# EAGLE design komahub-v1.2 (EAGLE 9.1.0)
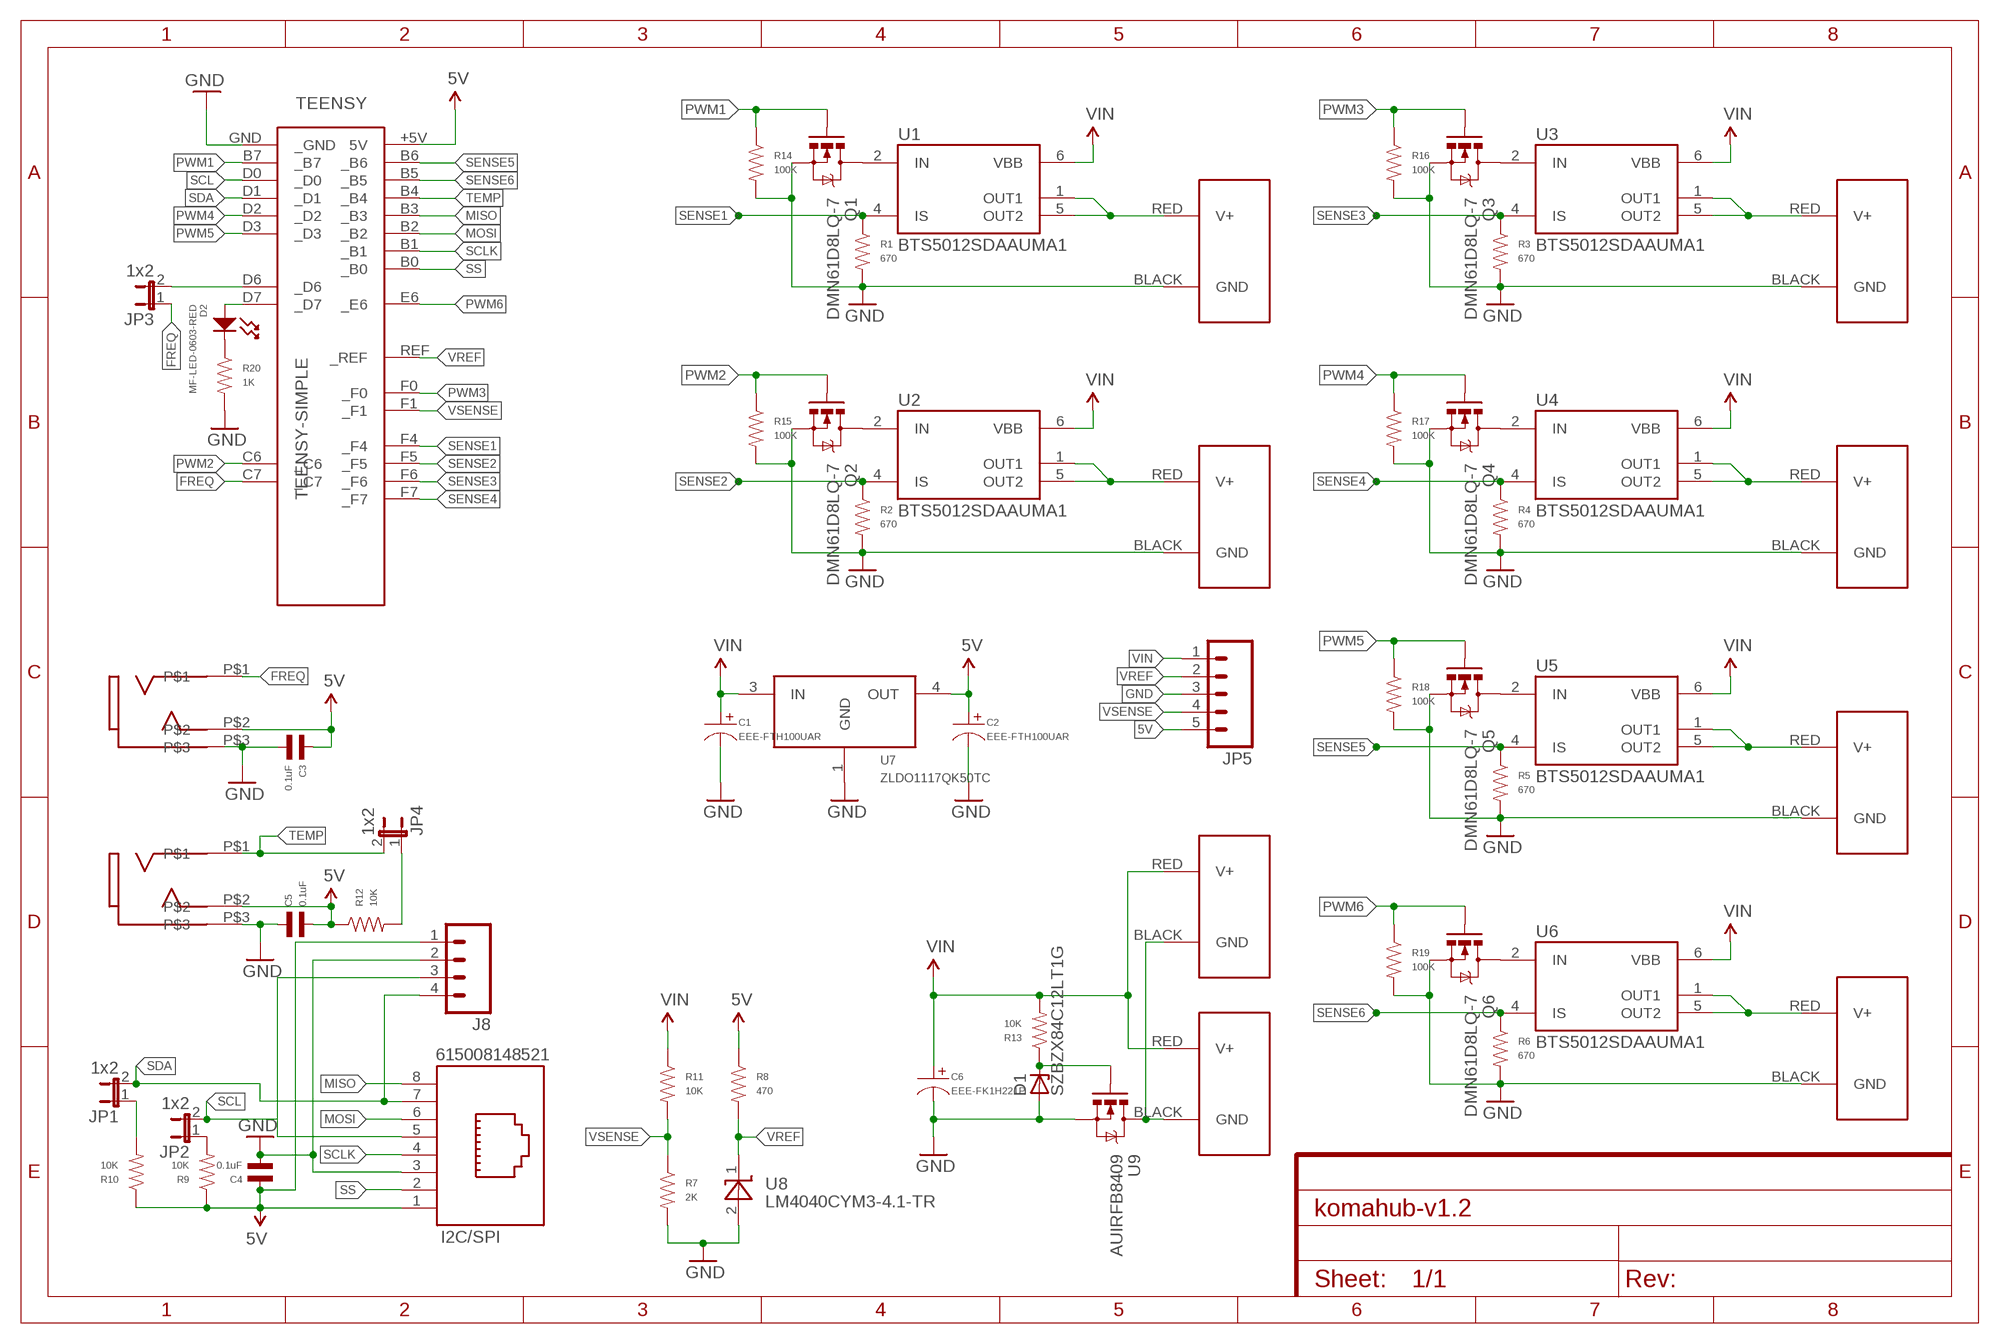
[diagram p0: schematic, sheet 1]
FRAME1 (FRAME-A4L): CNAME: KomaHub; CREVISION: 1.2; DESIGNER: Jari Saukkonen

## Parts
C1  EEE-FTH100UAR  CAPACITOR_P_4MM  [CP4MM]
C2  EEE-FTH100UAR  CAPACITOR_P_4MM  [CP4MM]
C3  0.1uF  CAPACITOR_NP_0603  [C0603]
C4  0.1uF  CAPACITOR_NP_0603  [C0603]
C5  0.1uF  CAPACITOR_NP_0603  [C0603]
C6  EEE-FK1H221P  CAPACITOR_P_10MM  [CP10MM]
D1  SZBZX84C12LT1G  ZENER-DIODESOT23  [SOT23]
D2  MF-LED-0603-RED  LED_SINGLE-0603-RED  [LED0603]
FREQ  35RASMT2BHNTRX  [35RASMT2BHNTRX]
I2C/SPI  615008148521  [615008148521]
J1  POWERPOLE_POWER25A_HORIZONTAL_G11  [POWERPOLE_PAIR_25A_HORIZ_G11]
J2  POWERPOLE_POWER25A_HORIZONTAL_G11  [POWERPOLE_PAIR_25A_HORIZ_G11]
J3  POWERPOLE_POWER25A_HORIZONTAL_G12  [POWERPOLE_PAIR_25A_HORIZ_G12]
J4  POWERPOLE_POWER25A_HORIZONTAL_G12  [POWERPOLE_PAIR_25A_HORIZ_G12]
J5  POWERPOLE_POWER25A_HORIZONTAL_G12  [POWERPOLE_PAIR_25A_HORIZ_G12]
J6  POWERPOLE_POWER25A_HORIZONTAL_G11  [POWERPOLE_PAIR_25A_HORIZ_G11]
J7  POWERPOLE_POWER25A_HORIZONTAL_G11  [POWERPOLE_PAIR_25A_HORIZ_G11]
J8  M04PTH  [1X04]
J9  POWERPOLE_POWER25A_HORIZONTAL_G12  [POWERPOLE_PAIR_25A_HORIZ_G12]
JP1  1x2  JUMPER-2PTH  [1X02]
JP2  1x2  JUMPER-2PTH  [1X02]
JP3  1x2  JUMPER-2PTH  [1X02]
JP4  1x2  JUMPER-2PTH  [1X02]
JP5  M05PTH  [1X05]
Q1  DMN61D8LQ-7  MOSFET-NCHANNELAO3404A  [SOT23-3]
Q2  DMN61D8LQ-7  MOSFET-NCHANNELAO3404A  [SOT23-3]
Q3  DMN61D8LQ-7  MOSFET-NCHANNELAO3404A  [SOT23-3]
Q4  DMN61D8LQ-7  MOSFET-NCHANNELAO3404A  [SOT23-3]
Q5  DMN61D8LQ-7  MOSFET-NCHANNELAO3404A  [SOT23-3]
Q6  DMN61D8LQ-7  MOSFET-NCHANNELAO3404A  [SOT23-3]
R1  670  RESISTOR_0603  [R0603]
R2  670  RESISTOR_0603  [R0603]
R3  670  RESISTOR_0603  [R0603]
R4  670  RESISTOR_0603  [R0603]
R5  670  RESISTOR_0603  [R0603]
R6  670  RESISTOR_0603  [R0603]
R7  2K  RESISTOR_0603  [R0603]
R8  470  RESISTOR_0603  [R0603]
R9  10K  RESISTOR_0603  [R0603]
R10  10K  RESISTOR_0603  [R0603]
R11  10K  RESISTOR_0603  [R0603]
R12  10K  RESISTOR_0603  [R0603]
R13  10K  RESISTOR_0603  [R0603]
R14  100K  RESISTOR_0603  [R0603]
R15  100K  RESISTOR_0603  [R0603]
R16  100K  RESISTOR_0603  [R0603]
R17  100K  RESISTOR_0603  [R0603]
R18  100K  RESISTOR_0603  [R0603]
R19  100K  RESISTOR_0603  [R0603]
R20  1K  RESISTOR_0603  [R0603]
TEENSY  TEENSY-SIMPLE  [TEENSY-SIMPLE]
TEMP  35RASMT2BHNTRX  [35RASMT2BHNTRX]
U1  BTS5012SDAAUMA1  BTS5016SDA  [TO114P998X235-5_6N]
U2  BTS5012SDAAUMA1  BTS5016SDA  [TO114P998X235-5_6N]
U3  BTS5012SDAAUMA1  BTS5016SDA  [TO114P998X235-5_6N]
U4  BTS5012SDAAUMA1  BTS5016SDA  [TO114P998X235-5_6N]
U5  BTS5012SDAAUMA1  BTS5016SDA  [TO114P998X235-5_6N]
U6  BTS5012SDAAUMA1  BTS5016SDA  [TO114P998X235-5_6N]
U7  ZLDO1117QK50TC  NCV1117  [DPAK]
U8  LM4040CYM3-4.1-TR  LM4040CYM3-2.5  [SOT-23]
U9  AUIRFB8409  [TO220AV]

## Nets
5V: C2.P$1 C3.P$1 C4.P$1 C5.P$2 FREQ.P$2 I2C/SPI.1 J8.1 JP5.5 R8.P$1 R9.P$1 R10.P$1 R12.P$1 TEENSY.+5V(5V) TEMP.P$2 U7.4(OUT)
FREQ: FREQ.P$1 JP3.1 TEENSY.C7(_C7)
GND: C1.P$2 C2.P$2 C3.P$2 C4.P$2 C5.P$1 C6.P$2 D1.1(A) FREQ.P$3 I2C/SPI.3 J1.BLACK(GND) J2.BLACK(GND) J3.BLACK(GND) J5.BLACK(GND) J7.BLACK(GND) J8.2 J9.BLACK(GND) JP5.3 Q1.2(S) Q2.2(S) Q3.2(S) Q4.2(S) Q5.2(S) Q6.2(S) R1.P$2 R2.P$2 R3.P$2 R4.P$2 R5.P$2 R6.P$2 R7.P$2 R14.P$2 R15.P$2 R16.P$2 R17.P$2 R18.P$2 R19.P$2 R20.P$2 TEENSY.GND(_GND) TEMP.P$3 U7.1(GND) U8.2(A) U9.3(S)
GNDIN: J4.BLACK(GND) J6.BLACK(GND) U9.2(D)
MISO: I2C/SPI.8 TEENSY.B3(_B3)
MOSI: I2C/SPI.6 TEENSY.B2(_B2)
N$1: JP3.2 TEENSY.D6(_D6)
N$2: JP2.1 R9.P$2
N$3: JP4.1 R12.P$2
N$4: JP1.1 R10.P$2
N$6: D1.3(C) R13.P$1 U9.1(G)
N$7: D2.CATHODE R20.P$1
N$8: D2.ANODE TEENSY.D7(_D7)
PWM1: Q1.1(G) R14.P$1 TEENSY.B7(_B7)
PWM2: Q2.1(G) R15.P$1 TEENSY.C6(_C6)
PWM3: Q3.1(G) R16.P$1 TEENSY.F0(_F0)
PWM4: Q4.1(G) R17.P$1 TEENSY.D2(_D2)
PWM5: Q5.1(G) R18.P$1 TEENSY.D3(_D3)
PWM6: Q6.1(G) R19.P$1 TEENSY.E6(_E6)
PWMT1: Q1.3(D) U1.2(IN)
PWMT2: Q2.3(D) U2.2(IN)
PWMT3: Q3.3(D) U3.2(IN)
PWMT4: Q4.3(D) U4.2(IN)
PWMT5: Q5.3(D) U5.2(IN)
PWMT6: Q6.3(D) U6.2(IN)
PWR1: J2.RED(V+) U1.1(OUT1) U1.5(OUT2)
PWR2: J3.RED(V+) U2.1(OUT1) U2.5(OUT2)
PWR3: J1.RED(V+) U3.1(OUT1) U3.5(OUT2)
PWR4: J5.RED(V+) U4.1(OUT1) U4.5(OUT2)
PWR5: J7.RED(V+) U5.1(OUT1) U5.5(OUT2)
PWR6: J9.RED(V+) U6.1(OUT1) U6.5(OUT2)
SCL: I2C/SPI.5 J8.3 JP2.2 TEENSY.D0(_D0)
SCLK: I2C/SPI.4 TEENSY.B1(_B1)
SDA: I2C/SPI.7 J8.4 JP1.2 TEENSY.D1(_D1)
SENSE1: R1.P$1 TEENSY.F4(_F4) U1.4(IS)
SENSE2: R2.P$1 TEENSY.F5(_F5) U2.4(IS)
SENSE3: R3.P$1 TEENSY.F6(_F6) U3.4(IS)
SENSE4: R4.P$1 TEENSY.F7(_F7) U4.4(IS)
SENSE5: R5.P$1 TEENSY.B6(_B6) U5.4(IS)
SENSE6: R6.P$1 TEENSY.B5(_B5) U6.4(IS)
SS: I2C/SPI.2 TEENSY.B0(_B0)
TEMP: JP4.2 TEENSY.B4(_B4) TEMP.P$1
VIN: C1.P$1 C6.P$1 J4.RED(V+) J6.RED(V+) JP5.1 R11.P$1 R13.P$2 U1.6(VBB) U2.6(VBB) U3.6(VBB) U4.6(VBB) U5.6(VBB) U6.6(VBB) U7.3(IN)
VREF: JP5.2 R8.P$2 TEENSY.REF(_REF) U8.1(C)
VSENSE: JP5.4 R7.P$1 R11.P$2 TEENSY.F1(_F1)

## Library data of the parts
C1 C2 = MF_Passives:CAPACITOR_P: Library: MF_Passives Description: Device for Polarized Capacitors. Manufacture part number (MPN), Voltage Rating, and Tolerance can be added via Attributes. Check https://factory.macrofab.com/parts for the house parts list.; MPN: MF-CAP-4MM-10uF; POPULATE: 1
C3-C5 = MF_Passives:CAPACITOR_NP: Library: MF_Passives Description: Device for Non-Polarized Capacitors. Manufacture part number (MPN) can be added via Attributes. Check https://factory.macrofab.com/parts for the house parts list.; POPULATE: 1
C6 = MF_Passives:CAPACITOR_P: Library: MF_Passives Description: Device for Polarized Capacitors. Manufacture part number (MPN), Voltage Rating, and Tolerance can be added via Attributes. Check https://factory.macrofab.com/parts for the house parts list.; MPN: EEE-FT1H221AP; POPULATE: 1
D1 = diode:ZENER-DIODE: Z-Diode
D2 = MF_LEDs:LED_SINGLE: Library: MF_LEDs Description: Device for Single LED Packages. Manufacture part number (MFG#) can be added via Attributes.; HOUSEPART: YES; MPN: MF-LED-0603-RED; POPULATE: 1; URL: https://factory.macrofab.com/part/MF-LED-0603-RED
FREQ TEMP = alvarop-lib:35RASMT2BHNTRX
I2C/SPI = EAGLE-INPUT_OUTPUT_CONNECTORS-rev17a:615008148521: WR-MJ_Modular Jacks_Plastic WR-MJ_Modular Jacks_Plastic_Horizontal_Tab UP <http://katalog.we-online.de/media/images/eican/Con_WR-MJ_Horizontal_Plastic%20_615008148521_pf2.jpg> Details see: http://katalog.we-online.de/en/em/MJ_HORIZONTAL_PLASTIC_8P8C_TAB_UP Created 2014-12-22, aslant tao 2014 (C) Würth Elektronik
J1-J7 J9 = powerpoles:POWERPOLE_POWER: Anderson Powerpole Power Connector using ameteur radio standard layout
J8 = SparkFun-Connectors:M04: Header 4 Standard 4-pin 0.1" header. Use with straight break away headers (SKU : PRT-00116), right angle break away headers (PRT-00553), swiss pins (PRT-00743), machine pins (PRT-00117), and female headers (PRT-00115). Molex polarized connector foot print use with SKU : PRT-08231 with associated crimp pins and housings. 1MM SMD Version SKU: PRT-10208; PROD_ID: CONN-09696
JP1-JP4 = SparkFun-Retired:JUMPER-2: Jumper Basic 0.1" spaced jumper. Use with breakaway headers.
JP5 = SparkFun-Connectors:M05: Header 5 Standard 5-pin 0.1" header. Use with straight break away headers (SKU : PRT-00116), right angle break away headers (PRT-00553), swiss pins (PRT-00743), machine pins (PRT-00117), and female headers (PRT-00115). Molex polarized connector foot print use with SKU : PRT-08230 with associated crimp pins and housings.
Q1-Q6 = SparkFun-DiscreteSemi:MOSFET-NCHANNEL: Common NMOSFET Parts MFG P/N Store ID Prod ID FDD8780 TRANS-09984 SI7820DN TRANS-11055 FDS6630A IC-08089 2N7002PW TRANS-11151 FQP30N06L COM-10213 TRANS-10060 BSS123LT1G TRANS-08345 BSS138 TRANS-00830 BS170 2N7000; PROD_ID: TRAN-12988
R1-R6 = MF_Passives:RESISTOR: Library: MF_Passives Description: Device for Resistors. Manufacture part number (MPN), Voltage, Tolerance, and Wattage Rating can be added via Attributes. Check https://factory.macrofab.com/parts for the house parts list.; MPN: CR0603-FX-6800ELF; POPULATE: 1
R7 R14-R19 = MF_Passives:RESISTOR: Library: MF_Passives Description: Device for Resistors. Manufacture part number (MPN), Voltage, Tolerance, and Wattage Rating can be added via Attributes. Check https://factory.macrofab.com/parts for the house parts list.; MPN: MF-RES-0603-2K; POPULATE: 1
R8 = MF_Passives:RESISTOR: Library: MF_Passives Description: Device for Resistors. Manufacture part number (MPN), Voltage, Tolerance, and Wattage Rating can be added via Attributes. Check https://factory.macrofab.com/parts for the house parts list.; MPN: MF-RES-0603-470; POPULATE: 1
R9-R13 = MF_Passives:RESISTOR: Library: MF_Passives Description: Device for Resistors. Manufacture part number (MPN), Voltage, Tolerance, and Wattage Rating can be added via Attributes. Check https://factory.macrofab.com/parts for the house parts list.; MPN: MF-RES-0603-10K; POPULATE: 1
R20 = MF_Passives:RESISTOR: Library: MF_Passives Description: Device for Resistors. Manufacture part number (MPN), Voltage, Tolerance, and Wattage Rating can be added via Attributes. Check https://factory.macrofab.com/parts for the house parts list.; POPULATE: 1
TEENSY = teensy:TEENSY-SIMPLE: Teensy 2.0 Original Design by Clint Fisher Modified Design by Tamir Emran Licensed Under Creative Commons Attribution-ShareAlike 3.0 Unported (CC BY-SA 3.0)
U1-U6 = BTS5016SDA:BTS5016SDA: BTS5016SDA Smart High-Side Power Switch TO114P998X235-5_6N
U7 = on-semiconductor:NCV1117
U8 = GuShH:LM4040
U9 = components:AUIRFB8409; MPN: AUIRFB8409

## Board
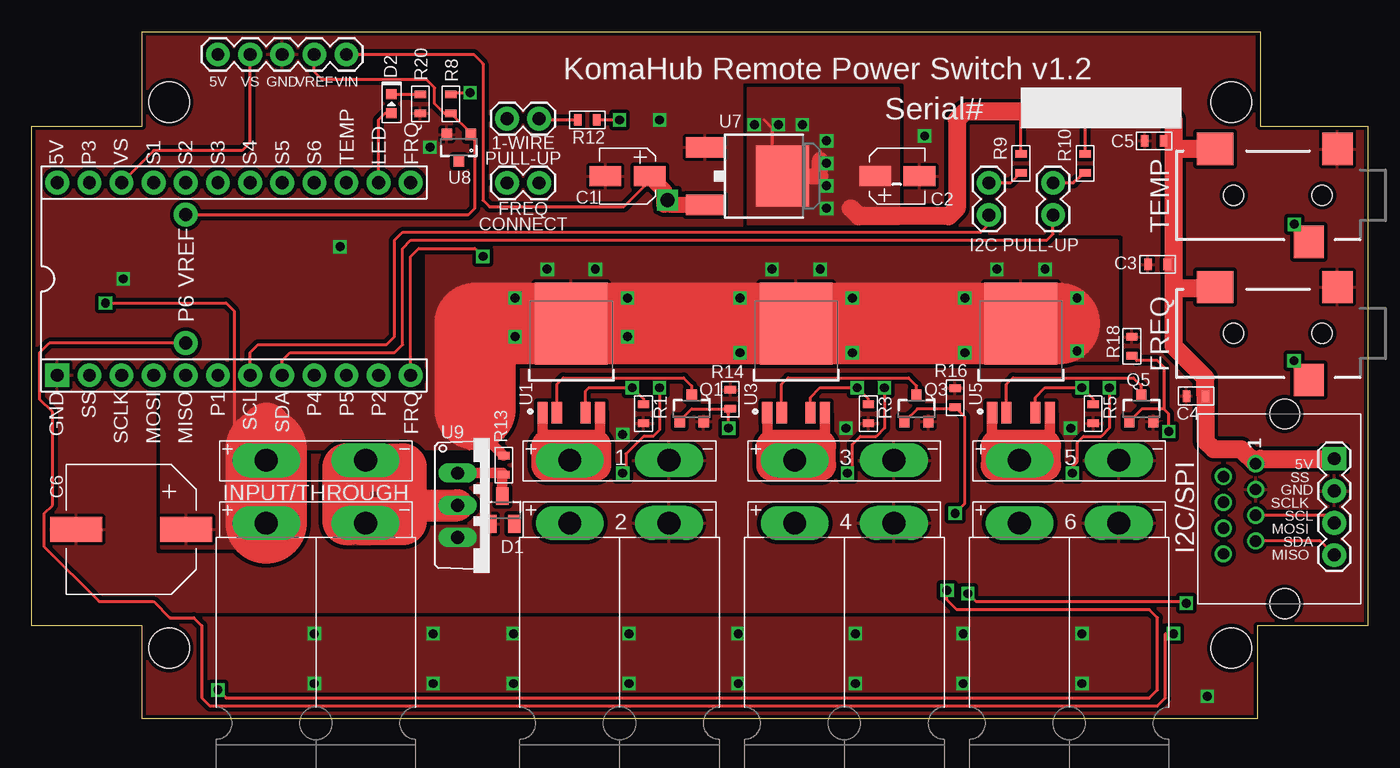
[diagram p1: board, top side]
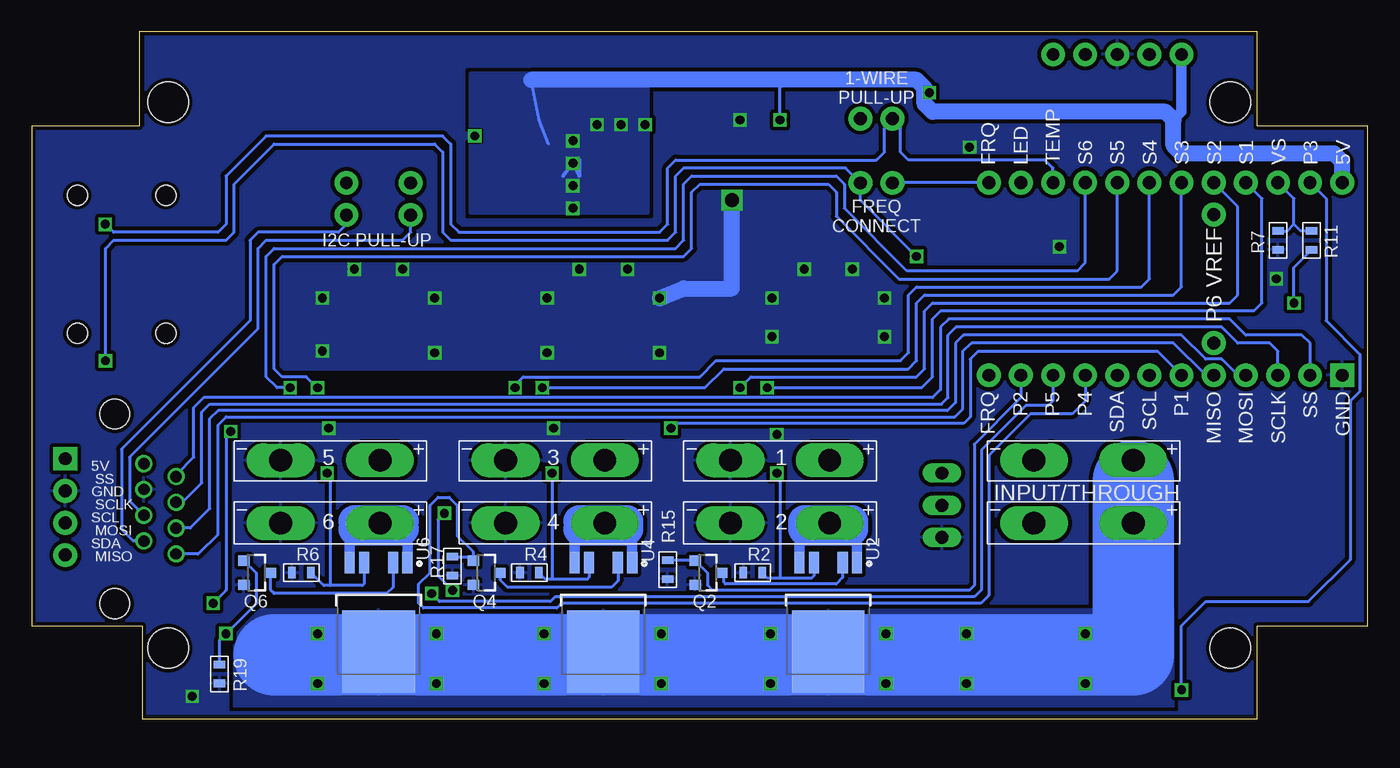
[diagram p2: board, bottom side, seen from below]

Size 105.66 x 54.36 mm. Coordinates in mm from the lower left corner, seen from the top.
Outline: 8.76,0 8.76,7.37 0,7.37 0,46.86 8.76,46.86 8.76,54.36 97.16,54.36 97.16,46.86 105.66,46.86 105.66,7.37 96.9,7.37 96.9,0 8.76,0
Copper layers (1*16): Top 0.035mm / dielectric 1.5mm / Bottom 0.035mm
Design rules "MF_Standard_2_Layer *": minimum track width 5mil, minimum drill 12mil, track to track 5mil, track to pad 5mil, pad to pad 5mil, via to via 5mil, smd to smd 0mil, copper to edge 10mil, drill to drill 10mil, minimum pad ring 6mil, minimum via ring 6mil, stop-mask expansion 2mil, vias tented up to drill 45mil, thermal gap 10mil
Holes 3.2 mm at 94.87,48.77 94.87,5.59 10.87,48.77 10.87,5.59

### Footprints (pad centres in the part's own frame; a part is rotated, then mirrored left to right if it is on the bottom)
CP4MM = smd 1.6 x 2.5: P$1 0,-1.75; P$2 0,1.75
C0603 = smd 0.6 x 0.9: P$1 -0.75,0; P$2 0.75,0
CP10MM = smd 2 x 4.1: P$1 0,-4.35; P$2 0,4.35
SOT23 = smd 1 x 1.4: 1 -0.95,-1.1; 2 0.95,-1.1; 3 0,1.1
LED0603 = smd 0.8 x 0.8: ANODE 0.75,0; CATHODE -0.75,0
35RASMT2BHNTRX = smd 2.4 x 2.55: P$1 -2.44,3.675; P$3 -4.7,-3.675 | smd 2.9 x 2.55: P$2 4.96,-3.675 | hole 1.6: -3.5,0; 3.5,0
615008148521 = drill 0.9: 1 3.57,2.3; 2 2.55,4.84; 3 1.53,2.3; 4 0.51,4.84; 5 -0.51,2.3; 6 -1.53,4.84; 7 -2.55,2.3; 8 -3.57,4.84 | hole 2.36: -7.5,0; 7.5,0
POWERPOLE_PAIR_25A_HORIZ_G11 = drill 1.8 long: BLACK -3.925,-6.096; RED 3.925,-6.096
POWERPOLE_PAIR_25A_HORIZ_G12 = drill 1.8 long: BLACK -3.925,-1.13; RED 3.925,-1.13
1X04 = drill 1.016 pad 1.88 square: 1 0,0 | drill 1.016 pad 1.88: 2 2.54,0; 3 5.08,0; 4 7.62,0
1X02 = drill 1.016 pad 1.88: 1 0,0; 2 2.54,0
1X05 = drill 1.016 pad 1.88: 1 0,0; 2 2.54,0; 3 5.08,0; 4 7.62,0; 5 10.16,0
SOT23-3 = smd 0.8 x 0.9: 1 -0.95,-1; 2 0.95,-1; 3 0,1.1
R0603 = smd 0.6 x 0.9: P$1 -0.75,0; P$2 0.75,0
TEENSY-SIMPLE = drill 1.016 pad 1.88: +5V -13.97,7.62; B0 -11.43,-7.62; B1 -8.89,-7.62; B2 -6.35,-7.62; B3 -3.81,-7.62; B4 8.89,7.62; B5 6.35,7.62; B6 3.81,7.62; B7 -1.27,-7.62; C6 11.43,-7.62; C7 13.97,-7.62; D0 1.27,-7.62; D1 3.81,-7.62; D2 6.35,-7.62; D3 8.89,-7.62; D6 13.97,7.62; D7 11.43,7.62; E6 -3.81,-5.08; F0 -11.43,7.62; F1 -8.89,7.62; F4 -6.35,7.62; F5 -3.81,7.62; F6 -1.27,7.62; F7 1.27,7.62; REF -3.81,5.08 | drill 1.016 pad 1.88 square: GND -13.97,-7.62
TO114P998X235-5_6N = smd 1.7 x 0.8: 1 -4.75,2.28; 2 -4.75,1.14; 4 -4.75,-1.14; 5 -4.75,-2.28 | smd 6.5 x 5.75: 6 2.3,0
DPAK = smd 1.6 x 3: 1 -2.28,-2.77; 3 2.28,-2.77 | smd 4.826 x 4.191: 4 0,3.366
SOT-23 = smd 0.8 x 0.9: 1 -0.95,-1; 2 0.95,-1; 3 0,1.1
TO220AV = drill 1.016 long: 1 -2.54,-2.54; 2 0,-2.54; 3 2.54,-2.54

### Placement (x,y rotation side)
C1  47.12,42.93 90 top
C2  68.45,42.93 270 top
C3  89.03,35.94 180 top
C4  92.08,25.53 180 top
C5  88.77,45.72 0 top
C6  7.87,14.99 90 top
D1  37.21,16.51 0 top
D2  28.45,48.64 270 top
FREQ  98.55,30.48 180 top
I2C/SPI  99.09,16.61 90 top
J1  64.26,14.35 180 top
J2  46.48,14.35 180 top
J3  46.48,14.35 180 top
J4  22.48,14.35 180 top
J5  64.26,14.35 180 top
J6  22.48,14.35 180 top
J7  82.04,14.35 180 top
J8  103,20.57 270 top
J9  82.04,14.35 180 top
JP1  80.77,42.39 270 top
JP2  75.69,42.39 270 top
JP3  40.13,42.39 180 top
JP4  40.13,47.47 180 top
JP5  24.89,52.55 180 top
Q1  52.2,24.51 0 top
Q2  52.2,11.56 270 bottom
Q3  69.98,24.51 0 top
Q4  69.72,11.56 270 bottom
Q5  87.76,24.51 0 top
Q6  87.88,11.56 270 bottom
R1  48.39,24.13 270 top
R2  48.64,11.56 180 bottom
R3  66.17,24.13 270 top
R4  66.29,11.56 180 bottom
R5  83.95,24.13 270 top
R6  84.33,11.56 180 bottom
R7  7.11,37.85 270 bottom
R8  33.15,48.64 270 top
R9  78.23,43.94 270 top
R10  83.31,43.94 270 top
R11  4.45,37.85 90 bottom
R12  43.94,47.37 180 top
R13  37.34,20.07 90 top
R14  55.24,25.27 90 top
R15  55.37,11.81 270 bottom
R16  73.03,25.4 90 top
R17  72.39,12.07 270 bottom
R18  87,29.46 90 top
R19  90.8,3.56 270 bottom
R20  30.73,48.64 270 top
TEENSY  16,34.8 0 top
TEMP  98.55,41.4 180 top
U1  42.67,28.96 90 top
U2  42.67,7.62 270 bottom
U3  60.45,28.96 90 top
U4  60.45,7.62 270 bottom
U5  78.23,28.96 90 top
U6  78.23,7.62 270 bottom
U7  56.01,42.93 270 top
U8  33.78,45.21 180 top
U9  36.22,16.89 270 top

### Tracks (layer width: path | path; a pad name or v marks a point on that pad's centre or on a via)
5V  (via drill 0.7)
  Top 0.254: 78.98,47.87 79.12,48.01 79.26,47.87 | FREQ.P$2 93.21,34.02 | 80,47.87 80.14,48.01 80.28,47.87 | R9.P$1 78.23,48.01 | R10.P$1 83.31,47.5 82.68,48.01 | 57.91,47.37 58.55,46.74 58.55,43.75 | R8.P$1 33.29,49.53 v34.67,49.53 | C5.P$2 90.41,44.31 90.3,44.2 | C3.P$1 89.78,34.56 90.3,34.04 | R12.P$1 v46.48,47.37
  Top 0.305: 62.36,44.83 62.36,44.2
  Top 0.406: 58.55,43.75 U7.4
  Top 1.27: U7.4 62.36,42.93 62.36,44.2
  Top 1.422: 64.77,40.39 65.41,39.75 72.52,39.75 73.15,40.39 73.15,47.37 73.79,48.01 78.23,48.01 79.12,48.01 80.14,48.01 82.68,48.01 89.66,48.01 90.3,47.37 90.3,44.58 | 90.3,44.58 90.3,44.2 90.3,34.04 90.3,32.77 | 90.3,32.77 90.3,29.48 92.83,26.95 C4.P$1 92.83,21.98 93.47,21.34 95.63,21.34 I2C/SPI.1 97.18,20.57 J8.1 103,20.7 | 93.21,34.02 90.28,34.02 90.3,32.77 | TEMP.P$2 90.8,45.08 90.3,44.58
  Bottom 0.254: 64.77,45.47 65.53,47.37 66.17,50.55 | v34.67,49.53 35.37,50.23 | v46.48,47.37 46.48,50.55
  Bottom 0.305: 63.63,42.93 v62.86,43.94 62.36,42.93 62.36,44.2
  Bottom 0.813: JP5.5 14.73,48.01 15.37,47.37
  Bottom 1.27: TEENSY.+5V 2.03,44.07 2.67,44.7 14.73,44.7 15.37,45.34 15.37,47.37 16,48.01 34.42,48.01 35.05,48.64 35.05,49.91 35.37,50.23 35.69,50.55 46.48,50.55 66.17,50.55
  other vias: 62.86,40.39 62.86,45.72 57.15,46.99 59.05,46.99 60.96,46.99 62.86,42.16
  pour Top (no thermals): 56.64,49.86 56.64,39.17 68.58,39.17 68.58,49.86
  pour Bottom (no thermals): 56.9,51.05 70.99,51.05 70.99,40.01 56.9,40.01
FREQ  (via drill 0.7)
  Top 0.254: TEENSY.C7 29.97,36.58 30.61,37.21 35.05,37.21 v35.69,36.58 | v99.82,28.32 100.98,27.05 FREQ.P$1
  Bottom 0.254: v99.82,28.32 99.82,37.21 99.19,37.85 90.3,37.85 89.66,38.48 89.66,42.29 86.49,45.47 73.79,45.47 73.15,44.83 73.15,38.48 72.52,37.85 55.37,37.85 54.74,38.48 54.74,42.93 54.1,43.56 41.3,43.56 JP3.1 40.13,41.02 v35.69,36.58
GND  (via drill 0.7)
  Top 0.254: U7.1 53.24,45.24 53.47,45.47
  other vias: 46.74,22.48 64.39,22.99 82.17,22.99 24.38,37.34 92.96,1.78 7.24,34.8 31.5,45.21 70.61,46.1 49.66,47.37
  pour Top (isolate 0.305, rank 2): 0.13,46.74 9.02,46.74 9.02,54.36 96.65,54.36 96.65,46.74 105.54,46.74 105.54,7.37 96.65,7.37 96.65,-0.25 9.02,-0.25 9.02,7.37 0.13,7.37
  pour Bottom (isolate 0.305, rank 2): 0.13,46.74 9.02,46.74 9.02,54.36 96.65,54.36 96.65,46.74 105.54,46.74 105.54,7.37 96.65,7.37 96.65,-0.25 9.02,-0.25 9.02,7.37 0.13,7.37
  pour Top (no thermals): 31.88,15.24 35.69,15.24 35.69,11.81 31.88,11.81
GNDIN
  Top 0.254: 26.16,15.62 26.16,19.05 J6.BLACK | J4.BLACK 31.1,15.48 30.61,16.89
  Top 2.54: 30.61,16.89 U9.2 | J4.BLACK 25.03,15.62
  Top 3.81: 25.03,15.62 24.89,15.62 24.89,19.89 29.34,19.89 29.34,15.62 26.16,15.62
  pour Top: 25.53,18.8 25.53,16.89 28.07,16.89 28.07,18.8
  pour Top: 26.8,13.72 24.89,13.72 24.89,15.62 26.8,15.62
MISO
  Bottom 0.254: TEENSY.B3 12.83,27.18 15.37,29.72 31.34,29.72 32.03,29.08 32.03,24.51 32.66,23.88 90.3,23.88 90.93,23.24 90.93,14.61 92.5,13.04 I2C/SPI.8
MOSI
  Bottom 0.254: TEENSY.B2 10.29,27.18 11.56,28.45 12.83,28.45 14.73,30.35 31.98,30.35 32.61,29.72 32.61,25.02 33.25,24.38 90.93,24.38 91.57,23.75 91.57,16.64 93.12,15.08 I2C/SPI.6
N$1
  Bottom 0.254: TEENSY.D6 37.57,42.42 JP3.2
N$2
  Top 0.254: JP2.1 77.43,42.39 R9.P$2
N$3
  Top 0.254: JP4.1 40.23,47.37 R12.P$2
N$4
  Top 0.254: 82.92,42.93 R10.P$2 82.39,42.39 JP1.1
N$6
  Top 0.813: U9.1 37.21,19.43 | 37.21,19.43 37.22,19.43 R13.P$1 | D1.3 37.21,19.43
N$7
  Top 0.254: D2.CATHODE R20.P$1
N$8
  Top 0.254: TEENSY.D7 27.43,47.37 27.95,47.89 D2.ANODE
PWM1  (via drill 0.7)
  Top 0.254: Q1.1 51.25,23.56 52.2,24.51 54.74,24.51 54.93,24.32 | v55.12,22.99 55.12,24.13 54.93,24.32 | R14.P$1 55.13,24.52 54.93,24.32
  Bottom 0.254: TEENSY.B7 16.64,29.08 30.81,29.08 31.45,28.45 31.45,23.88 31.95,23.37 54.74,23.37 v55.12,22.99
PWM2
  Bottom 0.254: TEENSY.C6 27.43,25.4 31.12,21.72 31.12,10.54 31.5,10.16 51.82,10.16 52.2,10.54 52.2,11.51 Q2.1 53.25,12.56 R15.P$1
PWM3  (via drill 0.7)
  Top 0.254: v73.03,16.26 73.79,17.02 73.79,23.88 73.15,24.51 73.03,24.51 | 73.03,24.51 70.03,24.51 Q3.1 | v14.73,2.29 15.37,1.65 88.39,1.65 89.03,2.29 89.03,8 88.39,8.64 73.15,8.64 72.39,9.4 v72.39,10.16 | R16.P$1 73.03,24.51
  Bottom 0.254: TEENSY.F0 3.3,41.15 3.3,31.5 0.64,28.83 0.64,25.91 1.4,25.15 1.4,12.57 4.7,9.27 12.83,9.27 14.73,7.37 v14.73,2.29 | v73.03,16.26 73.53,15.75 73.53,11.3 v72.39,10.16
PWM4
  Bottom 0.254: TEENSY.D2 22.35,25.15 23.37,24.13 26.67,24.13 29.97,20.83 29.97,9.78 30.61,9.14 63.75,9.14 64.14,8.76 74.68,8.76 75.06,9.14 75.06,10.67 74.17,11.56 74.17,16.89 73.53,17.53 72.64,17.53 72.01,16.89 72.01,14.48 70.72,13.19 Q4.1 71.03,12.82 R17.P$1
PWM5  (via drill 0.7)
  Top 0.254: v74.04,9.91 74.68,9.27 91.19,9.27 v91.31,9.14 | v89.92,22.73 89.92,24.13 89.53,24.51 | 89.53,24.51 87.81,24.51 Q5.1 | 89.53,24.51 89.53,27.81 89.03,28.32 87.39,28.32 R18.P$1
  Bottom 0.254: TEENSY.D3 24.89,25.15 25.27,24.77 27.05,24.77 30.56,21.26 30.56,10.21 31.12,9.65 64.26,9.65 64.64,9.27 73.41,9.27 v74.04,9.91 | v89.92,22.73 90.3,22.35 90.3,10.16 v91.31,9.14
PWM6  (via drill 0.7)
  Top 0.254: TEENSY.E6 1.4,29.72 0.64,28.96 0.64,25.27 1.65,24.26 1.65,16.89 1.02,16.26 1.02,13.59 5.33,9.27 9.65,9.27 10.92,8 12.83,8 13.46,7.37 13.46,1.65 14.1,1.02 89.03,1.02 89.66,1.65 89.66,6.73 v90.3,6.73
  Bottom 0.254: Q6.1 87.88,11.51 87.88,9.14 v90.3,6.73 90.8,6.22 R19.P$1
PWMT1
  Top 0.254: U1.2 41.53,26.47 42.04,26.97 51.56,26.97 52.2,26.34 Q1.3
PWMT2
  Bottom 0.254: U2.2 41.53,11.17 42.04,10.67 50.8,10.67 50.93,10.8 50.93,11.64 Q2.3
PWMT3
  Top 0.254: U3.2 59.31,26.47 59.82,26.97 69.34,26.97 69.98,26.34 Q3.3
PWMT4
  Bottom 0.254: U4.2 59.31,10.92 59.82,10.41 68.03,10.41 68.62,11.01 Q4.3
PWMT5
  Top 0.254: U5.2 77.09,26.47 77.6,26.97 87.12,26.97 87.76,26.34 Q5.3
PWMT6
  Bottom 0.254: U6.2 77.09,10.41 77.6,9.91 86.49,9.91 86.78,10.2 Q6.3
PWR1
  Top 0.254: 40.77,20.07 42.32,19.05 J2.RED
  Top 0.813: U1.5 44.95,21.08 44.58,21.59 | U1.1 40.39,21.08 40.77,21.59
  Top 2.54: 40.77,20.07 44.58,20.07 44.58,21.59 40.77,21.59 40.77,20.07
PWR2
  Bottom 0.813: U2.5 44.95,14.61 44.58,14.99 | U2.1 40.39,14.61 40.77,14.99
  Bottom 2.54: J3.RED 44.58,14.99 | 44.58,14.99 40.77,14.99 40.77,15.62 44.58,15.62 44.58,14.99
PWR3
  Top 0.813: U3.1 58.17,20.44 58.55,20.07 | U3.5 62.73,21.08 62.36,21.59
  Top 2.54: J1.RED 58.91,20.05 58.55,20.07 | 58.55,20.07 62.36,20.07 62.36,21.59 58.55,21.59 58.55,20.07
PWR4
  Bottom 0.813: U4.1 58.17,14.61 58.55,14.99 | U4.5 62.73,14.61 62.36,14.99
  Bottom 2.54: J5.RED 58.69,15.48 58.55,15.62 | 58.55,15.62 62.36,15.62 62.36,14.99 58.55,14.99 58.55,15.62
PWR5
  Top 0.813: U5.1 75.95,20.44 76.33,20.07 | U5.5 80.51,21.08 80.14,21.59
  Top 2.54: J7.RED 76.82,20.18 76.33,20.07 | 76.33,20.07 80.14,20.07 80.14,21.59 76.33,21.59 76.33,20.07
PWR6
  Bottom 0.813: U6.1 75.95,14.61 76.33,14.99 | U6.5 80.51,14.61 80.14,14.99
  Bottom 2.54: J9.RED 76.47,15.48 76.33,15.62 | 76.33,15.62 80.14,15.62 80.14,14.99 76.33,14.99 76.33,15.62
SCL
  Top 0.254: TEENSY.D0 17.27,28.96 17.91,29.59 28.07,29.59 28.7,30.23 28.7,37.85 29.34,38.48 75.06,38.48 75.69,39.12 JP2.2 | J8.3 102.39,16.1 I2C/SPI.5
  Bottom 0.254: JP2.2 75.69,38.48 76.33,37.85 87.12,37.85 87.76,37.21 87.76,30.86 97.92,20.7 97.92,17.23 I2C/SPI.5
SCLK
  Bottom 0.254: TEENSY.B1 7.11,29.08 7.75,29.72 10.29,29.72 11.56,30.99 32.56,30.99 33.2,30.35 33.2,25.4 33.71,24.89 91.57,24.89 92.2,24.26 92.2,18.67 93.75,17.12 I2C/SPI.4
SDA
  Top 0.254: TEENSY.D1 19.81,28.32 20.45,28.96 28.7,28.96 29.34,29.59 29.34,37.21 29.97,37.85 80.26,37.85 80.77,38.35 JP1.2 | J8.4 101.89,14.06 I2C/SPI.7
  Bottom 0.254: JP1.2 80.77,39.12 81.41,38.48 87.76,38.48 88.39,37.85 88.39,31.5 98.55,21.34 98.55,14.99 97.63,14.06 I2C/SPI.7
SENSE1  (via drill 0.7)
  Top 0.254: R1.P$1 48.39,25.3 v47.5,26.19 44.07,26.19 43.81,25.93 U1.4
  Bottom 0.254: TEENSY.F4 8.38,41.15 8.38,32.89 9.02,32.26 33.78,32.26 34.42,31.62 34.42,27.05 35.28,26.19 v47.5,26.19
SENSE2  (via drill 0.7)
  Top 0.254: v49.66,26.19 49.66,22.86 49.15,22.35 48.39,22.35 46.99,20.95 46.99,19.68 v46.74,19.43
  Bottom 0.254: TEENSY.F5 10.29,40.51 10.29,33.53 10.92,32.89 34.42,32.89 35.05,32.26 35.05,27.69 35.69,27.05 48.79,27.05 v49.66,26.19 | 43.81,11.94 U2.4 43.81,11.31 43.99,11.12 46.48,11.12 | v46.74,19.43 46.48,19.18 46.48,11.12 | 46.48,11.12 47.46,11.12 R2.P$1
SENSE3  (via drill 0.7)
  Top 0.254: U3.4 61.59,25.42 62.36,26.19 v65.28,26.19 66.17,25.3 R3.P$1
  Bottom 0.254: TEENSY.F6 14.73,34.16 15.37,33.53 35.05,33.53 35.69,32.89 35.69,28.32 36.32,27.69 50.93,27.69 52.43,26.19 v65.28,26.19
SENSE4  (via drill 0.7)
  Top 0.254: v67.44,26.19 67.44,22.99 66.8,22.35 65.53,22.35 64.9,21.72 64.9,19.81 v64.52,19.43
  Bottom 0.254: TEENSY.F7 17.27,34.8 17.91,34.16 35.69,34.16 36.32,33.53 36.32,28.96 36.96,28.32 51.56,28.32 52.83,27.05 66.8,27.05 67.44,26.42 v67.44,26.19 | U4.4 61.59,11.18 61.72,11.05 64.52,11.05 | 64.52,11.05 65.01,11.05 R4.P$1 | v64.52,19.43 64.52,11.05
SENSE5  (via drill 0.7)
  Top 0.254: v83.06,26.19 83.17,26.19 | U5.4 79.37,25.42 80.14,26.19 v83.06,26.19 | R5.P$1 83.95,25.3 v83.06,26.19
  Bottom 0.254: TEENSY.B6 19.81,35.43 20.45,34.8 37.08,34.8 42.04,39.75 42.04,41.66 42.67,42.29 52.83,42.29 53.47,41.66 53.47,37.21 54.1,36.58 85.85,36.58 86.49,35.94 86.49,27.69 85.85,27.05 83.95,27.05 83.08,26.19 v83.06,26.19
SENSE6  (via drill 0.7)
  Top 0.254: v85.22,26.19 85.22,22.99 84.58,22.35 83.19,22.35 82.68,21.84 82.68,20.32 82.3,19.94 v82.3,19.43
  Bottom 0.254: TEENSY.B5 22.35,36.07 22.99,35.43 36.45,35.43 41.4,40.39 41.4,42.29 42.04,42.93 53.47,42.93 54.1,42.29 54.1,37.85 54.74,37.21 86.49,37.21 87.12,36.58 87.12,27.05 86.26,26.19 v85.22,26.19 | U6.4 79.37,10.67 79.5,10.54 82.04,10.54 | 82.04,10.54 82.04,19.05 82.3,19.3 v82.3,19.43 | 82.04,10.54 82.56,10.54 R6.P$1
SS
  Bottom 0.254: TEENSY.B0 4.57,29.72 5.21,30.35 9.65,30.35 10.92,31.62 33.15,31.62 33.78,30.99 33.78,26.04 34.42,25.4 92.08,25.4 92.84,24.64 92.84,20.7 94.25,19.29 I2C/SPI.2
TEMP  (via drill 0.7)
  Top 0.254: v99.85,39.12 101.09,37.85 101.09,36.58 100.99,36.68 TEMP.P$1
  Bottom 0.254: v99.85,39.12 99.82,39.12 99.19,38.48 90.93,38.48 90.3,39.12 90.3,42.93 87.12,46.1 73.15,46.1 72.52,45.47 72.52,39.12 71.88,38.48 56.01,38.48 55.37,39.12 55.37,43.56 54.74,44.2 38.86,44.2 38.23,44.83 38.23,46.74 JP4.2 36.96,46.74 36.96,44.83 36.32,44.2 25.53,44.2 24.89,43.56 TEENSY.B4
VIN  (via drill 0.7, 1.1)
  Top 0.254: 50.04,40.64 v50.29,41.02 | 53.23,31.89 v56.01,33.27 | 17.4,21.34 16,22.73 16,32.26 15.37,32.89 v5.84,32.89 | 34.59,21.39 34.59,21.34 35.05,21.79 35.05,22.61 | 50.93,40.39 52.98,40.39 U7.3 | v82.68,29.08 81.41,30.49 81.28,31.26 | 35.05,24.51 35.05,22.61 | 34.59,23.11 34.59,23.06 35.05,22.61 | C1.P$1 48.87,42.55 46.84,40.51 36.2,40.51 35.69,41.02 35.69,51.82 34.95,52.55 JP5.1
  Top 0.813: 18.54,21.34 17.4,21.34 | R13.P$2 36.36,21.79 35.05,21.79
  Top 1.27: U7.3 50.55,40.65 v50.29,41.02 | 50.04,40.64 50.04,41.76 C1.P$1
  Top 3.81: 18.54,21.34 18.55,21.34 18.55,23.11 | J4.RED 18.06,14.99
  Top 6.452: 81.28,31.26 U5.6 U3.6 U1.6 35.05,31.26 35.05,24.51 | 18.54,21.34 18.54,19.29 J6.RED J4.RED
  Bottom 0.254: v83.06,2.79 86.49,5.07 | U6.6 74.56,5.32 v73.66,6.73 | U4.6 56.78,5.32 v55.88,6.73 | U2.6 39.51,5.32 v38.1,6.73 | v65.15,2.79 v73.66,2.79 | v5.84,32.89 5.84,35.7 R11.P$1
  Bottom 1.27: v56.01,33.27 54.1,34.04 50.29,34.04 v50.29,41.02
  Bottom 6.452: 18.55,18.8 J4.RED 18.55,5.07 86.49,5.07
  other vias: 82.68,33.27 73.79,33.27 73.79,28.96 64.9,33.27 64.9,28.96 56.01,28.96 47.12,30.23 47.12,33.27 83.06,6.73 65.15,6.73 55.88,2.79 47.24,6.73 47.24,2.79 38.1,2.79 38.23,33.27 38.23,30.23 31.75,6.73 31.75,2.79 22.35,6.73 22.35,2.79 76.33,35.56 80.14,35.56 62.36,35.56 58.55,35.56 44.58,35.56 40.77,35.56
  pour Bottom (isolate 0.305): 36.32,35.31 39.5,39.12 42.04,42.29 53.47,42.29 53.47,36.58 86.49,36.58 86.49,27.69 36.32,27.69
  pour Top (isolate 0.305): 13.21,8 88.39,8 88.39,2.03 13.21,2.03
  pour Top (isolate 0.305): 10.29,13.46 10.29,25.78 21.08,25.78 20.45,13.46
  pour Top (isolate 0.305): 14.73,25.91 35.69,25.91 35.69,21.34 14.73,21.34
  pour Bottom (isolate 0.305): 15.37,8.64 89.66,8.64 89.66,1.02 15.37,1.02
  pour Top (isolate 0.305): 31.24,25.78 31.24,37.85 85.85,37.85 85.85,28.32 32.51,28.32 32.51,25.78
VREF
  Top 0.254: TEENSY.REF 34.54,39.88 35.05,40.39 35.05,45.89 U8.1 34.73,46.31 R8.P$2 32.63,47.89 31.88,48.64 31.88,49.91 31.24,50.55 22.99,50.55 22.35,51.18 JP5.2
VSENSE
  Top 0.254: TEENSY.F1 9.65,44.96 16.64,44.96 17.27,45.59 JP5.4
  Bottom 0.254: R7.P$1 6.36,38.6 5.84,39.12 | 5.84,39.12 5.84,41.15 TEENSY.F1 | R11.P$2 5.32,38.6 5.84,39.12

### Text on the board
tPlace: 5V | VS | GND | VREF | VIN | KomaHub Remote Power Switch v1.2 | Serial# | 5V / P3 / VS / S1 / S2 / S3 / S4 / S5 / S6 / TEMP / LED / FRQ | 1-WIRE / PULL-UP | VREF | FREQ / CONNECT | I2C PULL-UP | P6 | GND / SS / SCLK / MOSI / MISO / P1 / SCL / SDA / P4 / P5 / P2 / FRQ | 1 | 3 | 5 | INPUT/THROUGH | 2 | 4 | 6 | 5V / SS / GND / SCLK / SCL / MOSI / SDA / MISO
bPlace: 1-WIRE / PULL-UP | FRQ / LED / TEMP / S6 / S5 / S4 / S3 / S2 / S1 / VS / P3 / 5V | VREF | FREQ / CONNECT | I2C PULL-UP | P6 | FRQ / P2 / P5 / P4 / SDA / SCL / P1 / MISO / MOSI / SCLK / SS / GND | 1 | 3 | 5 | INPUT/THROUGH | 2 | 4 | 6 | 5V / SS / GND / SCLK / SCL / MOSI / SDA / MISO